# EasyEDA schematic Sheet_2.json
TITLE: Sheet_2; REV: 1.0; Date: 2021-06-14; Sheet: 1/1; Drawn By: usman.ashraf678; Company: Your Company
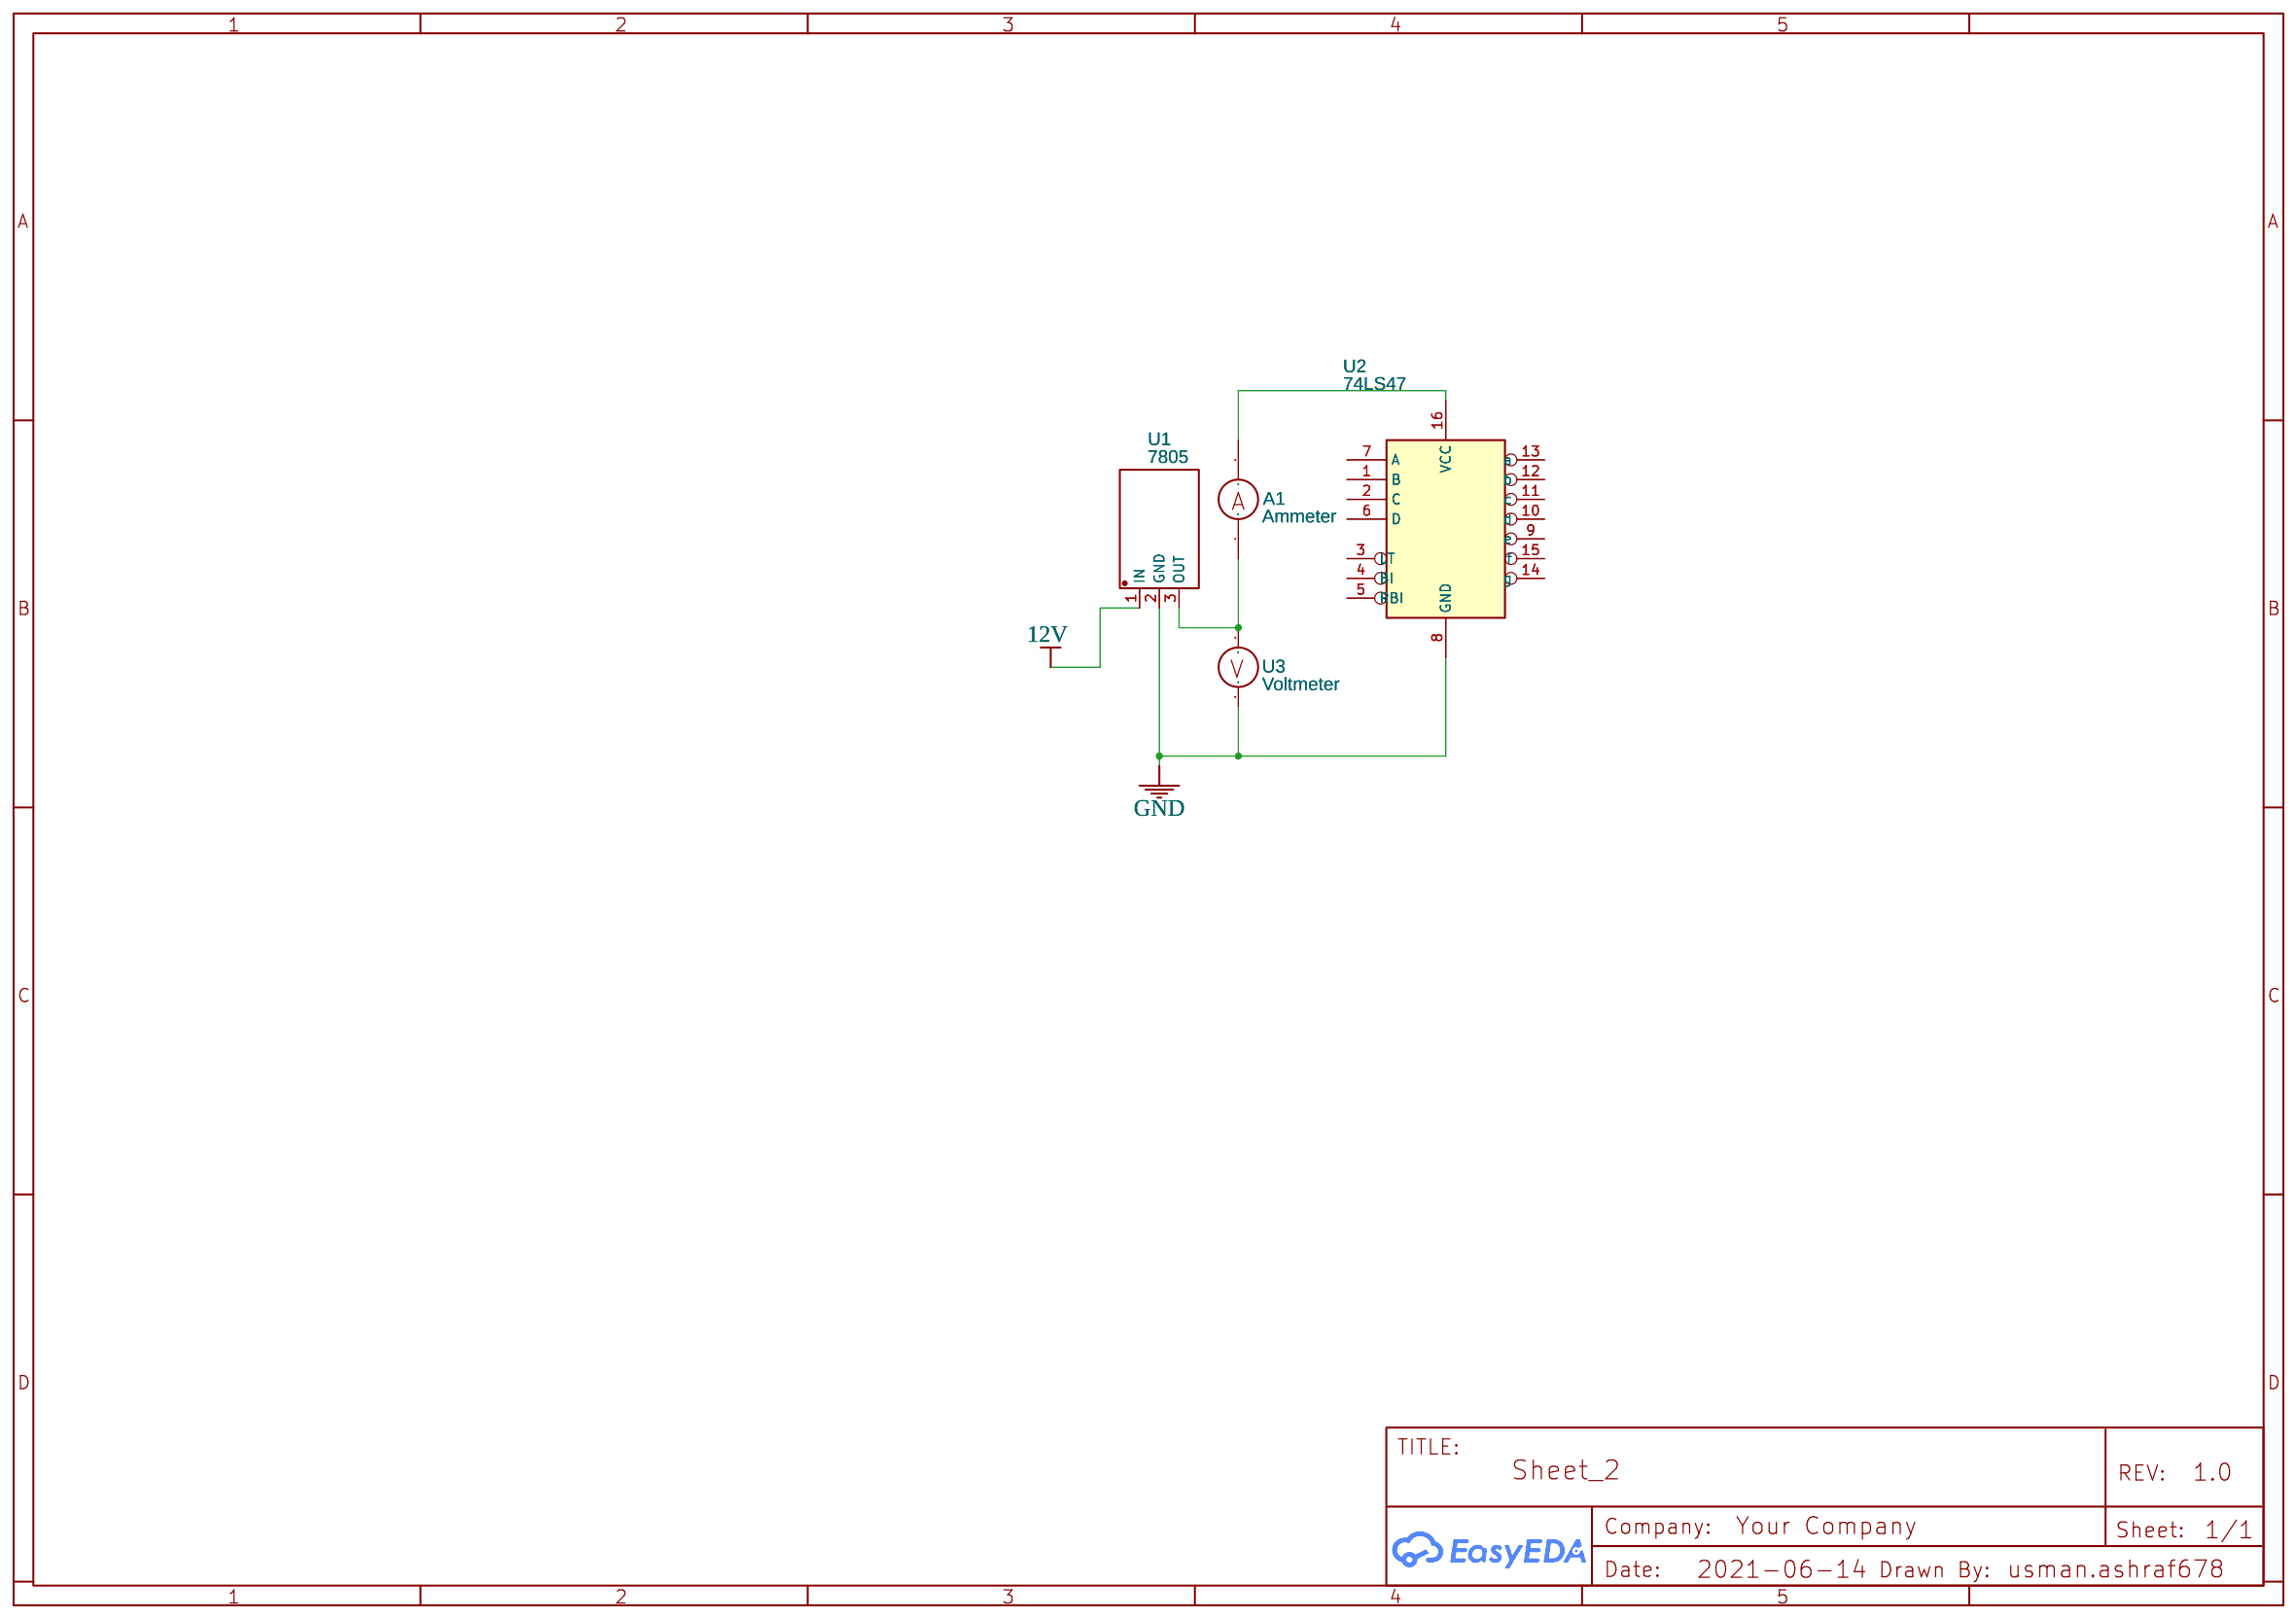
[diagram p0: schematic sheet]

## Parts
A1  Ammeter
U1  7805  [TO-220-3_L10.0-W4.5-P2.54-L]
U2  74LS47
U3  Voltmeter

## Library data of the parts
A1 = Ammeter: Contributor: NobodyCares
U1 = 7805: Supplier: LCSC; Supplier Part: C305416; Manufacturer: Foshan Blue Rocket Elec; Contributor: LCSC; JLCPCB Part Class: Extended Part
U2 = 74LS47: Contributor: Tgio
U3 = Voltmeter: Manufacturer Part: x; Contributor: jukilo159

## Nets
12V: U1.1(IN)
GND: U1.2(GND) U2.8(GND) U3.2
Net-(A1-1): A1.1 U1.3(OUT) U2.16(VCC) U3.1

Not connected (* = marked no-connect by the designer): U2 1(B) 2(C) 3(LT) 4(BI) 5(RBI) 6(D) 7(A) 9(e) 10(d) 11(c) 12(b) 13(a) 14(g) 15(f)
